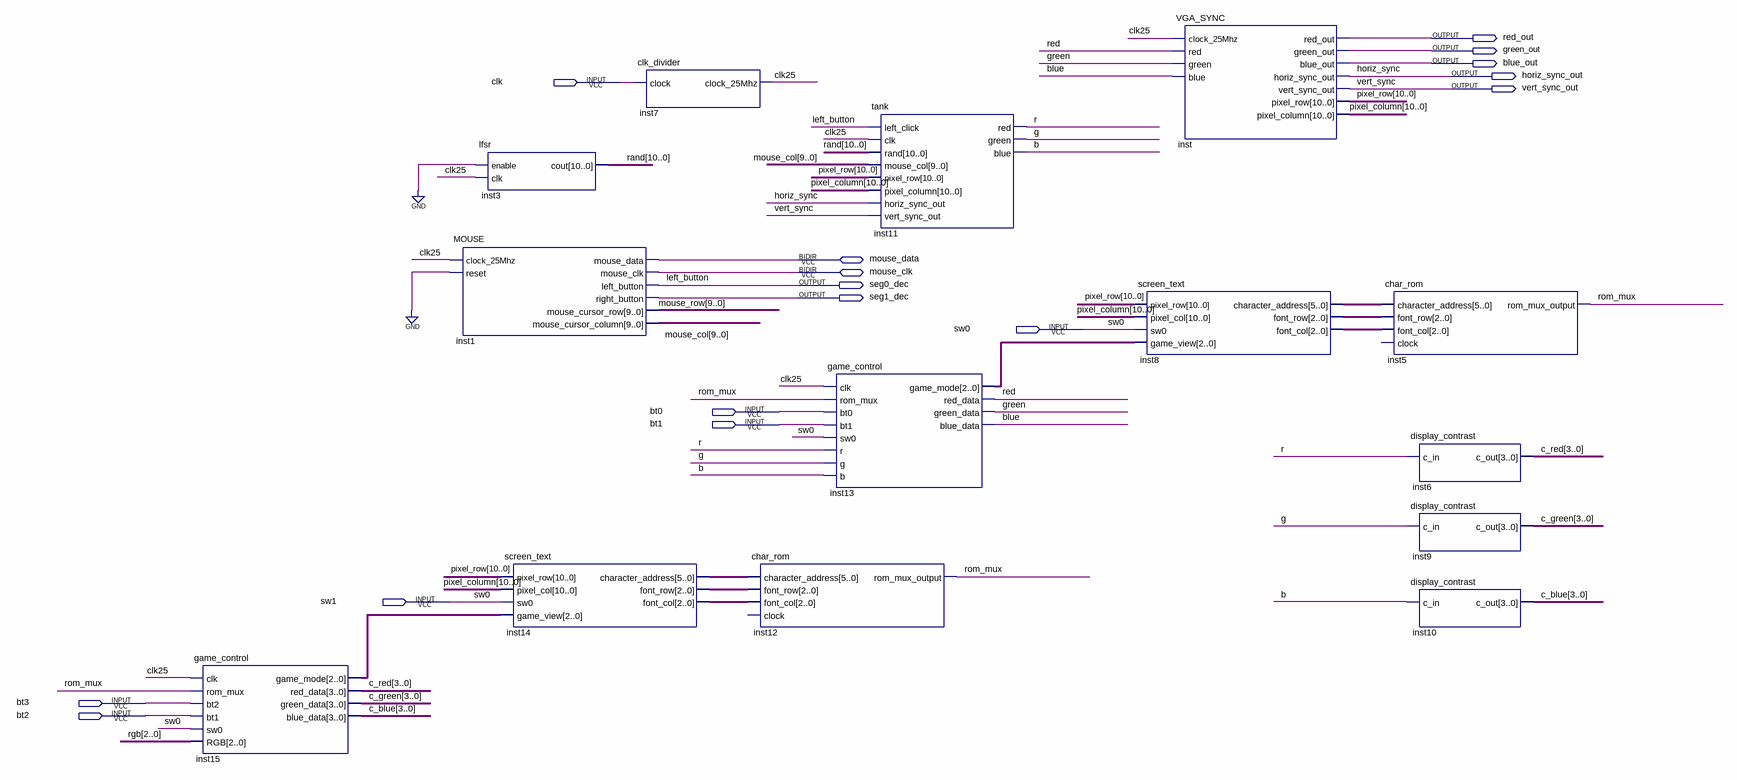
[diagram p0: schematic sheet]
// Quartus schematic mini_project_group09backup.bdf as structural Verilog: 14 symbols, 16 pins
module mini_project_group09backup (
  input  clk,
  input  sw0,
  input  bt0,
  input  bt1,
  input  sw1,
  input  bt3,
  input  bt2,
  inout  mouse_data,
  inout  mouse_clk,
  output red_out,
  output green_out,
  output blue_out,
  output horiz_sync_out,
  output vert_sync_out,
  output seg0_dec,
  output seg1_dec
);

  wire b, blue, clk25, g, green, r, red, rom_mux;
  wire [2:0] inst8_font_col, inst8_font_row, inst13_game_mode, inst14_font_col, inst14_font_row,
       inst15_game_mode, rgb;
  wire [3:0] c_blue, c_green, c_red;
  wire [5:0] inst8_character_address, inst14_character_address;
  wire [9:0] mouse_col, mouse_row;
  wire [10:0] pixel_column, pixel_row, \rand ;

  game_control inst15 (
    .clk(clk25), .rom_mux(rom_mux), .bt2(bt3), .bt1(bt2), .sw0(sw0), .RGB(rgb), .game_mode(inst15_game_mode),
    .red_data(c_red), .green_data(c_green), .blue_data(c_blue));
  lfsr inst3 (.enable(1'b0), .clk(clk25), .cout(\rand ));
  MOUSE inst1 (
    .clock_25Mhz(clk25), .reset(1'b0), .left_button(seg0_dec), .right_button(seg1_dec),
    .mouse_cursor_row(mouse_row), .mouse_cursor_column(mouse_col), .mouse_data(mouse_data),
    .mouse_clk(mouse_clk));
  screen_text inst14 (
    .pixel_row(pixel_row), .pixel_col(pixel_column), .sw0(sw0), .game_view(inst15_game_mode),
    .character_address(inst14_character_address), .font_row(inst14_font_row), .font_col(inst14_font_col));
  clk_divider inst7 (.clock(clk), .clock_25Mhz(clk25));
  char_rom inst12 (
    .character_address(inst14_character_address), .font_row(inst14_font_row), .font_col(inst14_font_col),
    .rom_mux_output(rom_mux));  // open: clock
  game_control inst13 (
    .clk(clk25), .rom_mux(rom_mux), .bt0(bt0), .bt1(bt1), .sw0(sw0), .r(r), .g(g), .b(b),
    .game_mode(inst13_game_mode), .red_data(red), .green_data(green), .blue_data(blue));
  tank inst11 (
    .left_click(seg0_dec), .clk(clk25), .\rand (\rand ), .mouse_col(mouse_col), .pixel_row(pixel_row),
    .pixel_column(pixel_column), .horiz_sync_out(horiz_sync_out), .vert_sync_out(vert_sync_out), .red(r),
    .green(g), .blue(b));
  screen_text inst8 (
    .pixel_row(pixel_row), .pixel_col(pixel_column), .sw0(sw0), .game_view(inst13_game_mode),
    .character_address(inst8_character_address), .font_row(inst8_font_row), .font_col(inst8_font_col));
  VGA_SYNC inst (
    .clock_25Mhz(clk25), .red(red), .green(green), .blue(blue), .red_out(red_out), .green_out(green_out),
    .blue_out(blue_out), .horiz_sync_out(horiz_sync_out), .vert_sync_out(vert_sync_out),
    .pixel_row(pixel_row), .pixel_column(pixel_column));
  char_rom inst5 (
    .character_address(inst8_character_address), .font_row(inst8_font_row), .font_col(inst8_font_col),
    .rom_mux_output(rom_mux));  // open: clock
  display_contrast inst6 (.c_in(r), .c_out(c_red));
  display_contrast inst9 (.c_in(g), .c_out(c_green));
  display_contrast inst10 (.c_in(b), .c_out(c_blue));

  assign sw1 = sw0;

  // Other names for the same wires on the sheet: horiz_sync = horiz_sync_out; left_button = seg0_dec;
  //   vert_sync = vert_sync_out
endmodule
